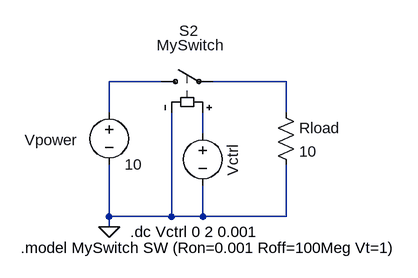
[diagram p0: schematic switch.asc]
switch.asc, the LTspice schematic file:
Version 4.1
SHEET 1 3448 2144
WIRE -544 80 -624 80
WIRE -352 80 -464 80
WIRE -624 128 -624 80
WIRE -352 128 -352 80
WIRE -480 160 -480 128
WIRE -624 288 -624 208
WIRE -528 288 -528 128
WIRE -528 288 -624 288
WIRE -480 288 -480 240
WIRE -480 288 -528 288
WIRE -352 288 -352 208
WIRE -352 288 -480 288
WIRE -624 304 -624 288
FLAG -624 304 0
SYMBOL voltage -480 144 R0
WINDOW 123 0 0 Left 0
WINDOW 39 0 0 Left 0
WINDOW 3 73 -311 VRight 2
WINDOW 0 46 34 VRight 2
SYMATTR Value ""
SYMATTR InstName Vctrl
SYMBOL sw -560 80 R270
WINDOW 0 78 73 VLeft 2
WINDOW 3 56 9 VRight 2
SYMATTR InstName S2
SYMATTR Value MySwitch
SYMBOL res -368 112 R0
SYMATTR InstName Rload
SYMATTR Value 10
SYMBOL voltage -624 112 R0
WINDOW 0 -130 58 Left 2
WINDOW 123 0 0 Left 0
WINDOW 39 0 0 Left 0
SYMATTR InstName Vpower
SYMATTR Value 10
TEXT -760 336 Left 2 !.model MySwitch SW (Ron=0.001 Roff=100Meg Vt=1)
TEXT -592 312 Left 2 !.dc Vctrl 0 2 0.001

The netlist it stands for:
* switch.asc
Vctrl N003 0
S2 N001 N002 N003 0 MySwitch
Rload N002 0 10
Vpower N001 0 10
.model MySwitch SW (Ron=0.001 Roff=100Meg Vt=1)
.dc Vctrl 0 2 0.001
.backanno
.end